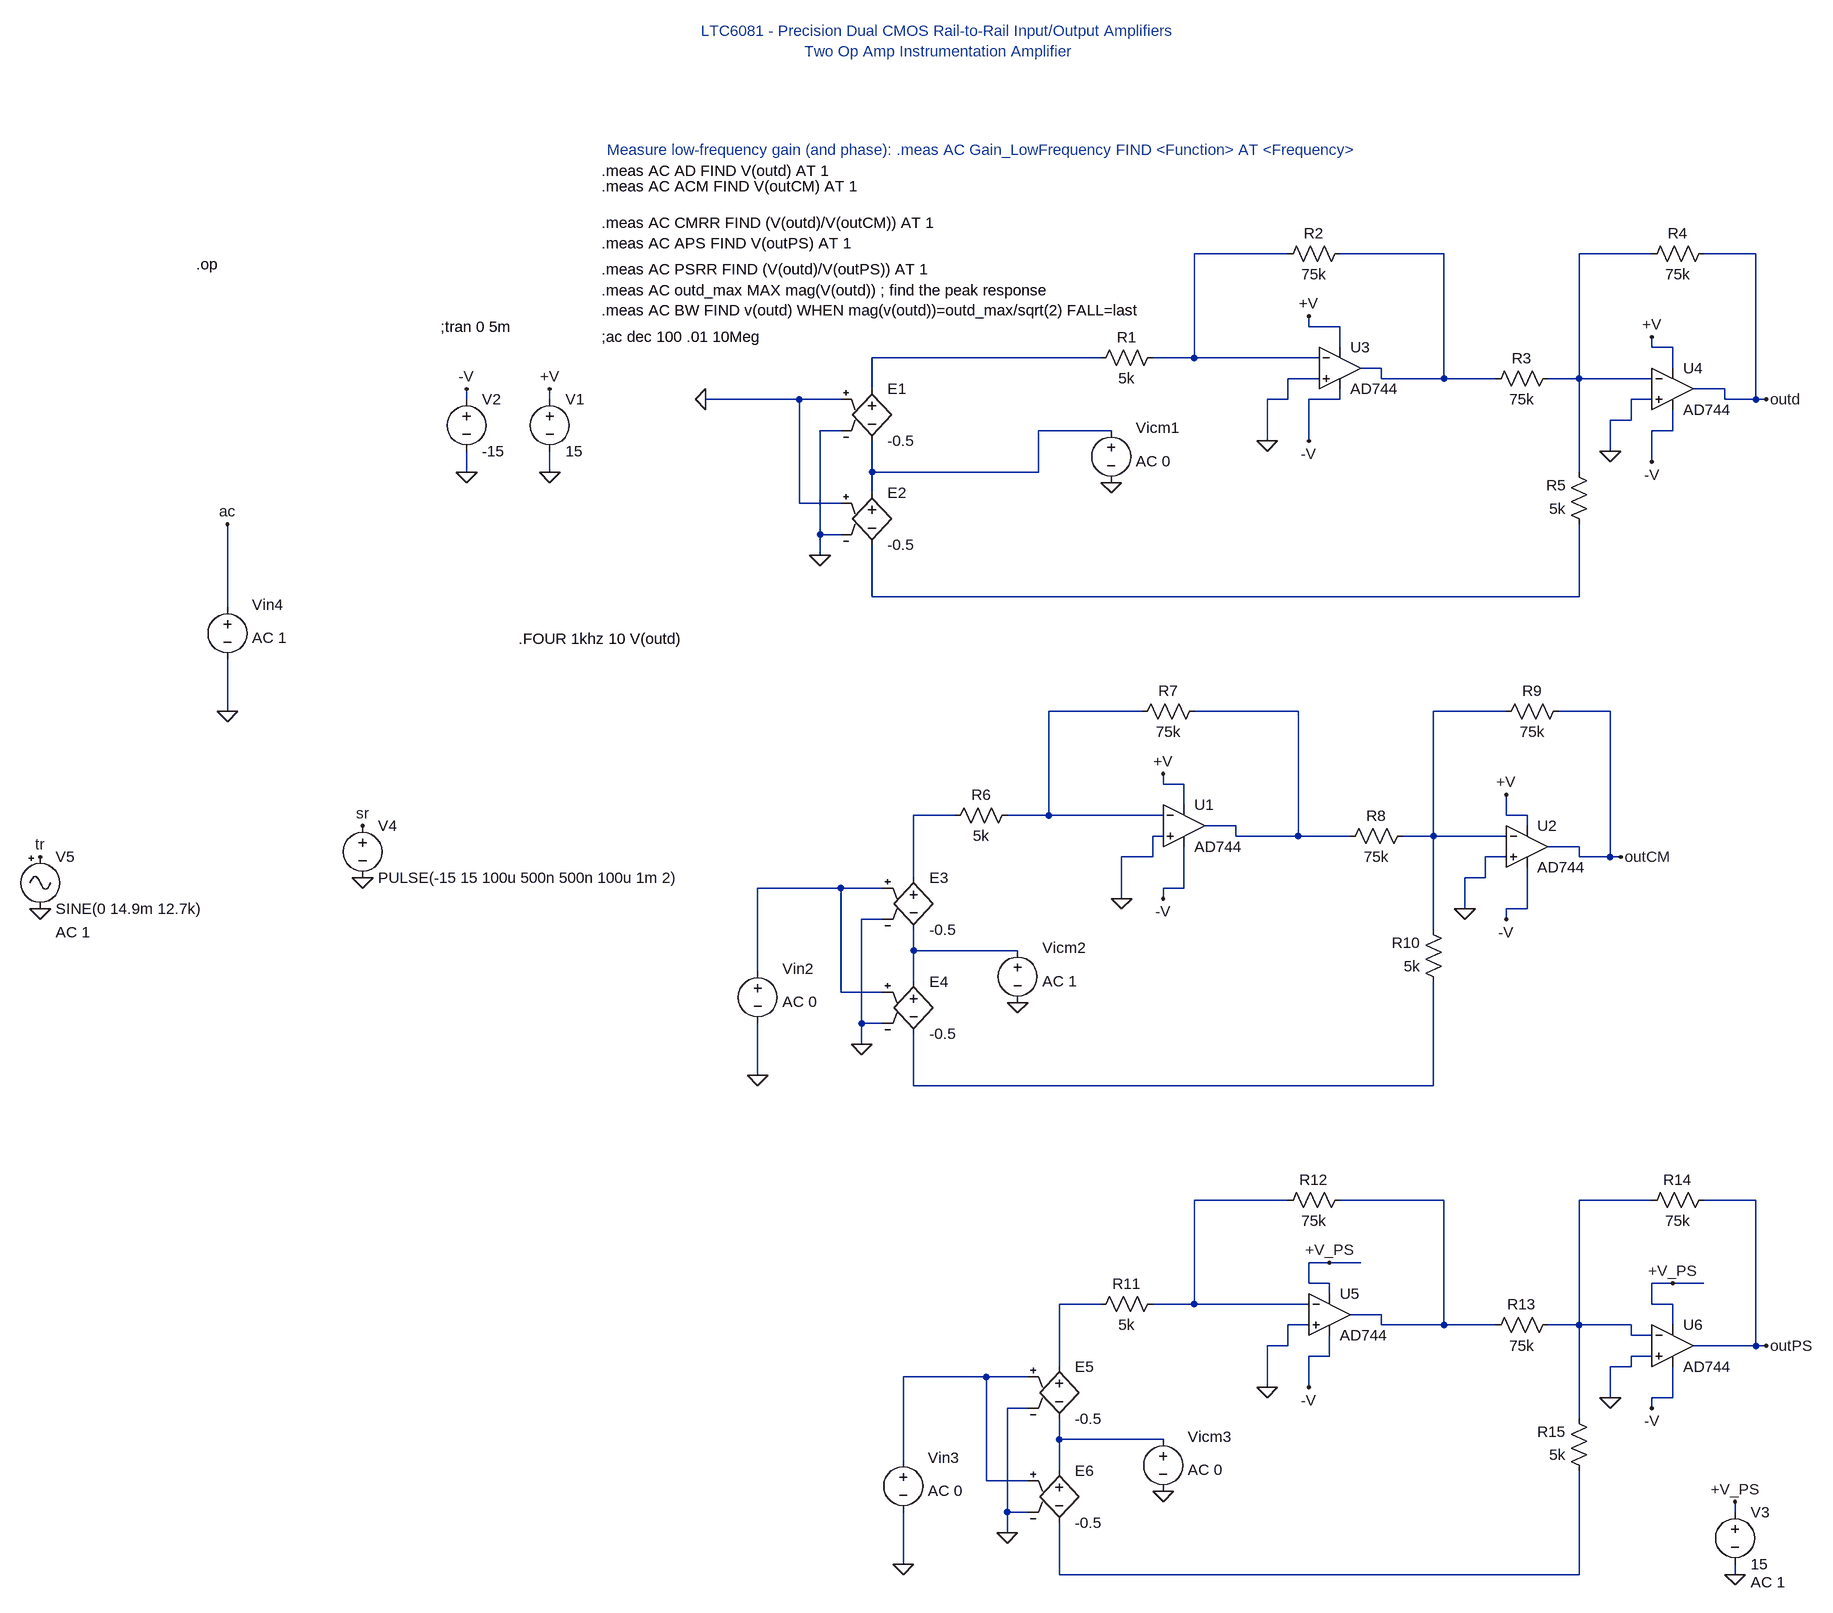
[diagram p0: schematic AI.asc]
AI.asc, the LTspice schematic file:
Version 4
SHEET 1 2588 2108
WIRE 96 48 -48 48
WIRE 336 48 176 48
WIRE 656 48 544 48
WIRE 816 48 736 48
WIRE 128 160 128 144
WIRE 176 160 128 160
WIRE 176 192 176 160
WIRE 656 192 656 176
WIRE 688 192 656 192
WIRE -192 208 -544 208
WIRE -48 208 -48 48
WIRE -48 208 -112 208
WIRE 144 208 -48 208
WIRE 240 224 208 224
WIRE 688 224 688 192
WIRE 144 240 96 240
WIRE 240 240 240 224
WIRE 336 240 336 48
WIRE 336 240 240 240
WIRE 416 240 336 240
WIRE 544 240 544 48
WIRE 544 240 496 240
WIRE 656 240 544 240
WIRE -544 256 -544 208
WIRE 768 256 720 256
WIRE -1168 272 -1168 256
WIRE -1040 272 -1040 256
WIRE -656 272 -800 272
WIRE -592 272 -656 272
WIRE 96 272 96 240
WIRE 96 272 64 272
WIRE 176 272 176 256
WIRE 176 272 128 272
WIRE 656 272 624 272
WIRE 768 272 768 256
WIRE 816 272 816 48
WIRE 816 272 768 272
WIRE 832 272 816 272
WIRE 624 304 624 272
WIRE 624 304 592 304
WIRE -592 320 -624 320
WIRE -176 320 -288 320
WIRE 688 320 688 288
WIRE 688 320 656 320
WIRE 64 336 64 272
WIRE 128 336 128 272
WIRE 592 352 592 304
WIRE 656 368 656 320
WIRE -1168 384 -1168 352
WIRE -1040 384 -1040 352
WIRE -544 384 -544 336
WIRE -288 384 -288 320
WIRE -288 384 -544 384
WIRE 544 384 544 240
WIRE -544 416 -544 384
WIRE -656 432 -656 272
WIRE -592 432 -656 432
WIRE -624 480 -624 320
WIRE -592 480 -624 480
WIRE -624 512 -624 480
WIRE -544 576 -544 496
WIRE 544 576 544 464
WIRE 544 576 -544 576
WIRE -1536 592 -1536 464
WIRE -1536 752 -1536 672
WIRE -128 752 -272 752
WIRE 112 752 -48 752
WIRE 432 752 320 752
WIRE 592 752 512 752
WIRE -96 864 -96 848
WIRE -64 864 -96 864
WIRE -64 896 -64 864
WIRE -416 912 -480 912
WIRE -272 912 -272 752
WIRE -272 912 -336 912
WIRE -96 912 -272 912
WIRE 432 912 432 880
WIRE 464 912 432 912
WIRE 16 928 -32 928
WIRE 464 928 464 912
WIRE -96 944 -112 944
WIRE 16 944 16 928
WIRE 112 944 112 752
WIRE 112 944 16 944
WIRE 192 944 112 944
WIRE 320 944 320 752
WIRE 320 944 272 944
WIRE 432 944 320 944
WIRE 544 960 496 960
WIRE -112 976 -112 944
WIRE -112 976 -160 976
WIRE 432 976 400 976
WIRE 544 976 544 960
WIRE 592 976 592 752
WIRE 592 976 544 976
WIRE 608 976 592 976
WIRE -480 1008 -480 912
WIRE 400 1008 400 976
WIRE 400 1008 368 1008
WIRE -592 1024 -720 1024
WIRE -528 1024 -592 1024
WIRE -64 1024 -64 960
WIRE -64 1024 -96 1024
WIRE -160 1040 -160 976
WIRE -96 1040 -96 1024
WIRE 368 1056 368 1008
WIRE 464 1056 464 992
WIRE 464 1056 432 1056
WIRE -528 1072 -560 1072
WIRE 432 1072 432 1056
WIRE 320 1088 320 944
WIRE -480 1120 -480 1088
WIRE -320 1120 -480 1120
WIRE -720 1152 -720 1024
WIRE -480 1168 -480 1120
WIRE -592 1184 -592 1024
WIRE -528 1184 -592 1184
WIRE -560 1232 -560 1072
WIRE -528 1232 -560 1232
WIRE -560 1264 -560 1232
WIRE -720 1312 -720 1232
WIRE -480 1328 -480 1248
WIRE 320 1328 320 1168
WIRE 320 1328 -480 1328
WIRE 96 1504 -48 1504
WIRE 336 1504 176 1504
WIRE 656 1504 544 1504
WIRE 816 1504 736 1504
WIRE 160 1600 128 1600
WIRE 208 1600 160 1600
WIRE 128 1632 128 1600
WIRE 160 1632 128 1632
WIRE 688 1632 656 1632
WIRE 736 1632 688 1632
WIRE 160 1648 160 1632
WIRE -192 1664 -256 1664
WIRE -48 1664 -48 1504
WIRE -48 1664 -112 1664
WIRE 128 1664 -48 1664
WIRE 656 1664 656 1632
WIRE 688 1664 656 1664
WIRE 240 1680 192 1680
WIRE 128 1696 96 1696
WIRE 240 1696 240 1680
WIRE 336 1696 336 1504
WIRE 336 1696 240 1696
WIRE 416 1696 336 1696
WIRE 544 1696 544 1504
WIRE 544 1696 496 1696
WIRE 624 1696 544 1696
WIRE 688 1696 688 1664
WIRE 624 1712 624 1696
WIRE 656 1712 624 1712
WIRE 96 1728 96 1696
WIRE 96 1728 64 1728
WIRE 816 1728 816 1504
WIRE 816 1728 720 1728
WIRE 832 1728 816 1728
WIRE 160 1744 160 1712
WIRE 160 1744 128 1744
WIRE 656 1744 624 1744
WIRE -256 1760 -256 1664
WIRE 624 1760 624 1744
WIRE 624 1760 592 1760
WIRE -368 1776 -496 1776
WIRE -304 1776 -368 1776
WIRE 64 1792 64 1728
WIRE 128 1792 128 1744
WIRE 592 1808 592 1760
WIRE 688 1808 688 1760
WIRE 688 1808 656 1808
WIRE -304 1824 -336 1824
WIRE 656 1824 656 1808
WIRE 544 1840 544 1696
WIRE -256 1872 -256 1840
WIRE -96 1872 -256 1872
WIRE -496 1904 -496 1776
WIRE -256 1920 -256 1872
WIRE -368 1936 -368 1776
WIRE -304 1936 -368 1936
WIRE -336 1984 -336 1824
WIRE -304 1984 -336 1984
WIRE 784 1984 784 1968
WIRE -336 2016 -336 1984
WIRE -496 2064 -496 1984
WIRE -256 2080 -256 2000
WIRE 544 2080 544 1920
WIRE 544 2080 -256 2080
WIRE 784 2080 784 2064
FLAG -1040 384 0
FLAG 128 144 +V
FLAG -1040 256 +V
FLAG 128 336 -V
FLAG -1168 384 0
FLAG -1168 256 -V
FLAG 656 176 +V
FLAG 656 368 -V
FLAG 832 272 outd
FLAG 64 336 0
FLAG 592 352 0
FLAG -96 848 +V
FLAG -96 1040 -V
FLAG 432 880 +V
FLAG 432 1072 -V
FLAG 608 976 outCM
FLAG -160 1040 0
FLAG 368 1056 0
FLAG -720 1312 0
FLAG -560 1264 0
FLAG -320 1200 0
FLAG 128 1792 -V
FLAG 656 1824 -V
FLAG 832 1728 outPS
FLAG 64 1792 0
FLAG 592 1808 0
FLAG -496 2064 0
FLAG -336 2016 0
FLAG -96 1952 0
FLAG 784 2080 0
FLAG 784 1968 +V_PS
FLAG 688 1632 +V_PS
FLAG 160 1600 +V_PS
FLAG -1536 752 0
FLAG -624 512 0
FLAG -176 400 0
FLAG -1328 1008 0
FLAG -1328 928 sr
FLAG -1824 1056 0
FLAG -1824 976 tr
FLAG -1536 464 ac
FLAG -800 272 0
DATAFLAG 784 272 ""
DATAFLAG 592 240 ""
DATAFLAG 384 240 ""
SYMBOL voltage -1040 256 R0
WINDOW 123 0 0 Left 2
WINDOW 39 0 0 Left 2
SYMATTR InstName V1
SYMATTR Value 15
SYMBOL voltage -1168 256 R0
WINDOW 123 0 0 Left 2
WINDOW 39 0 0 Left 2
SYMATTR InstName V2
SYMATTR Value -15
SYMBOL res -96 192 R90
WINDOW 0 0 56 VBottom 2
WINDOW 3 32 56 VTop 2
SYMATTR InstName R1
SYMATTR Value 5k
SYMBOL res 192 32 R90
WINDOW 0 0 56 VBottom 2
WINDOW 3 32 56 VTop 2
SYMATTR InstName R2
SYMATTR Value 75k
SYMBOL res 512 224 R90
WINDOW 0 0 56 VBottom 2
WINDOW 3 32 56 VTop 2
SYMATTR InstName R3
SYMATTR Value 75k
SYMBOL res 752 32 R90
WINDOW 0 0 56 VBottom 2
WINDOW 3 32 56 VTop 2
SYMATTR InstName R4
SYMATTR Value 75k
SYMBOL res 560 480 R180
WINDOW 0 36 76 Left 2
WINDOW 3 36 40 Left 2
SYMATTR InstName R5
SYMATTR Value 5k
SYMBOL res -320 896 R90
WINDOW 0 0 56 VBottom 2
WINDOW 3 32 56 VTop 2
SYMATTR InstName R6
SYMATTR Value 5k
SYMBOL res -32 736 R90
WINDOW 0 0 56 VBottom 2
WINDOW 3 32 56 VTop 2
SYMATTR InstName R7
SYMATTR Value 75k
SYMBOL res 288 928 R90
WINDOW 0 0 56 VBottom 2
WINDOW 3 32 56 VTop 2
SYMATTR InstName R8
SYMATTR Value 75k
SYMBOL res 528 736 R90
WINDOW 0 0 56 VBottom 2
WINDOW 3 32 56 VTop 2
SYMATTR InstName R9
SYMATTR Value 75k
SYMBOL res 336 1184 R180
WINDOW 0 36 76 Left 2
WINDOW 3 36 40 Left 2
SYMATTR InstName R10
SYMATTR Value 5k
SYMBOL voltage -720 1136 R0
WINDOW 123 38 63 Left 2
WINDOW 39 0 0 Left 2
WINDOW 0 38 12 Left 2
WINDOW 3 -188 38 Left 2
SYMATTR Value2 AC 0
SYMATTR InstName Vin2
SYMATTR Value ""
SYMBOL e -480 992 R0
SYMATTR InstName E3
SYMATTR Value -0.5
SYMBOL e -480 1152 R0
SYMATTR InstName E4
SYMATTR Value -0.5
SYMBOL voltage -320 1104 R0
WINDOW 123 38 63 Left 2
WINDOW 39 0 0 Left 2
WINDOW 0 38 12 Left 2
WINDOW 3 -188 38 Left 2
SYMATTR Value2 AC 1
SYMATTR InstName Vicm2
SYMATTR Value ""
SYMBOL res -96 1648 R90
WINDOW 0 0 56 VBottom 2
WINDOW 3 32 56 VTop 2
SYMATTR InstName R11
SYMATTR Value 5k
SYMBOL res 192 1488 R90
WINDOW 0 0 56 VBottom 2
WINDOW 3 32 56 VTop 2
SYMATTR InstName R12
SYMATTR Value 75k
SYMBOL res 512 1680 R90
WINDOW 0 0 56 VBottom 2
WINDOW 3 32 56 VTop 2
SYMATTR InstName R13
SYMATTR Value 75k
SYMBOL res 752 1488 R90
WINDOW 0 0 56 VBottom 2
WINDOW 3 32 56 VTop 2
SYMATTR InstName R14
SYMATTR Value 75k
SYMBOL res 560 1936 R180
WINDOW 0 36 76 Left 2
WINDOW 3 36 40 Left 2
SYMATTR InstName R15
SYMATTR Value 5k
SYMBOL voltage -496 1888 R0
WINDOW 123 38 63 Left 2
WINDOW 39 0 0 Left 2
WINDOW 0 38 12 Left 2
WINDOW 3 -188 38 Left 2
SYMATTR Value2 AC 0
SYMATTR InstName Vin3
SYMATTR Value ""
SYMBOL e -256 1744 R0
SYMATTR InstName E5
SYMATTR Value -0.5
SYMBOL e -256 1904 R0
SYMATTR InstName E6
SYMATTR Value -0.5
SYMBOL voltage -96 1856 R0
WINDOW 123 38 63 Left 2
WINDOW 39 0 0 Left 2
WINDOW 0 38 12 Left 2
WINDOW 3 -188 38 Left 2
SYMATTR Value2 AC 0
SYMATTR InstName Vicm3
SYMATTR Value ""
SYMBOL voltage 784 1968 R0
WINDOW 123 24 124 Left 2
WINDOW 39 0 0 Left 2
SYMATTR Value2 AC 1
SYMATTR InstName V3
SYMATTR Value 15
SYMBOL OpAmps\\AD744 176 160 R0
SYMATTR InstName U3
SYMBOL OpAmps\\AD744 688 192 R0
SYMATTR InstName U4
SYMBOL OpAmps\\AD744 -64 864 R0
SYMATTR InstName U1
SYMBOL OpAmps\\AD744 464 896 R0
SYMATTR InstName U2
SYMBOL voltage -1536 576 R0
WINDOW 123 38 63 Left 2
WINDOW 39 0 0 Left 2
WINDOW 0 38 12 Left 2
WINDOW 3 -188 38 Left 2
SYMATTR Value2 AC 1
SYMATTR InstName Vin4
SYMATTR Value ""
SYMBOL e -544 240 R0
SYMATTR InstName E1
SYMATTR Value -0.5
SYMBOL e -544 400 R0
SYMATTR InstName E2
SYMATTR Value -0.5
SYMBOL voltage -176 304 R0
WINDOW 123 38 63 Left 2
WINDOW 39 0 0 Left 2
WINDOW 0 38 12 Left 2
WINDOW 3 -188 38 Left 2
SYMATTR Value2 AC 0
SYMATTR InstName Vicm1
SYMATTR Value ""
SYMBOL OpAmps\\AD744 160 1616 R0
SYMATTR InstName U5
SYMBOL OpAmps\\AD744 688 1664 R0
SYMATTR InstName U6
SYMBOL voltage -1328 912 R0
WINDOW 123 0 0 Left 0
WINDOW 39 0 0 Left 0
SYMATTR InstName V4
SYMATTR Value PULSE(-15 15 100u 500n 500n 100u 1m 2)
SYMBOL Misc\\signal -1824 960 R0
WINDOW 123 24 132 Left 2
WINDOW 39 0 0 Left 0
SYMATTR Value2 AC 1
SYMATTR InstName V5
SYMATTR Value SINE(0 14.9m 12.7k)
TEXT -440 -248 Bottom 2 ;LTC6081 - Precision Dual CMOS Rail-to-Rail Input/Output Amplifiers\nTwo Op Amp Instrumentation Amplifier
TEXT -960 176 Left 2 !;ac dec 100 .01 10Meg
TEXT -960 -80 Left 2 !.meas AC AD FIND V(outd) AT 1
TEXT -952 -112 Left 2 ;Measure low-frequency gain (and phase): .meas AC Gain_LowFrequency FIND <Function> AT <Frequency>
TEXT -960 -56 Left 2 !.meas AC ACM FIND V(outCM) AT 1
TEXT -960 0 Left 2 !.meas AC CMRR FIND (V(outd)/V(outCM)) AT 1
TEXT -960 72 Left 2 !.meas AC PSRR FIND (V(outd)/V(outPS)) AT 1
TEXT -960 32 Left 2 !.meas AC APS FIND V(outPS) AT 1
TEXT -960 104 Left 2 !.meas AC outd_max MAX mag(V(outd)) ; find the peak response\n.meas AC BW FIND v(outd) WHEN mag(v(outd))=outd_max/sqrt(2) FALL=last
TEXT -1208 160 Left 2 !;tran 0 5m
TEXT -1088 640 Left 2 !.FOUR 1khz 10 V(outd)
TEXT -1584 64 Left 2 !.op

The netlist it stands for:
* AI.asc
V1 +V 0 15
V2 -V 0 -15
R1 N001 N004 5k
R2 N002 N001 75k
R3 N003 N002 75k
R4 outd N003 75k
R5 N006 N003 5k
R6 N007 N010 5k
R7 N008 N007 75k
R8 N009 N008 75k
R9 outCM N009 75k
R10 N013 N009 5k
Vin2 N011 0 AC 0
E3 N010 N012 N011 0 -0.5
E4 N012 N013 N011 0 -0.5
Vicm2 N012 0 AC 1
R11 N014 N017 5k
R12 N015 N014 75k
R13 N016 N015 75k
R14 outPS N016 75k
R15 N020 N016 5k
Vin3 N018 0 AC 0
E5 N017 N019 N018 0 -0.5
E6 N019 N020 N018 0 -0.5
Vicm3 N019 0 AC 0
V3 +V_PS 0 15 AC 1
XU3 0 N001 +V -V N002 AD744  ; pins In+ In- V+ V- OUT
XU4 0 N003 +V -V outd AD744  ; pins In+ In- V+ V- OUT
XU1 0 N007 +V -V N008 AD744  ; pins In+ In- V+ V- OUT
XU2 0 N009 +V -V outCM AD744  ; pins In+ In- V+ V- OUT
Vin4 ac 0 AC 1
E1 N004 N005 0 0 -0.5
E2 N005 N006 0 0 -0.5
Vicm1 N005 0 AC 0
XU5 0 N014 +V_PS -V N015 AD744  ; pins In+ In- V+ V- OUT
XU6 0 N016 +V_PS -V outPS AD744  ; pins In+ In- V+ V- OUT
V4 sr 0 PULSE(-15 15 100u 500n 500n 100u 1m 2)
V5 tr 0 SINE(0 14.9m 12.7k) AC 1
* LTC6081 - Precision Dual CMOS Rail-to-Rail Input/Output Amplifiers
* Two Op Amp Instrumentation Amplifier
;ac dec 100 .01 10Meg
.meas AC AD FIND V(outd) AT 1
* Measure low-frequency gain (and phase): .meas AC Gain_LowFrequency FIND <Function> AT <Frequency>
.meas AC ACM FIND V(outCM) AT 1
.meas AC CMRR FIND (V(outd)/V(outCM)) AT 1
.meas AC PSRR FIND (V(outd)/V(outPS)) AT 1
.meas AC APS FIND V(outPS) AT 1
.meas AC outd_max MAX mag(V(outd)) ; find the peak response
.meas AC BW FIND v(outd) WHEN mag(v(outd))=outd_max/sqrt(2) FALL=last
;tran 0 5m
.FOUR 1khz 10 V(outd)
.op
.backanno
.end